# Altium project LPCB218__RLOOP__COMMAND_NODE.PrjPCB (part 2 of 2)
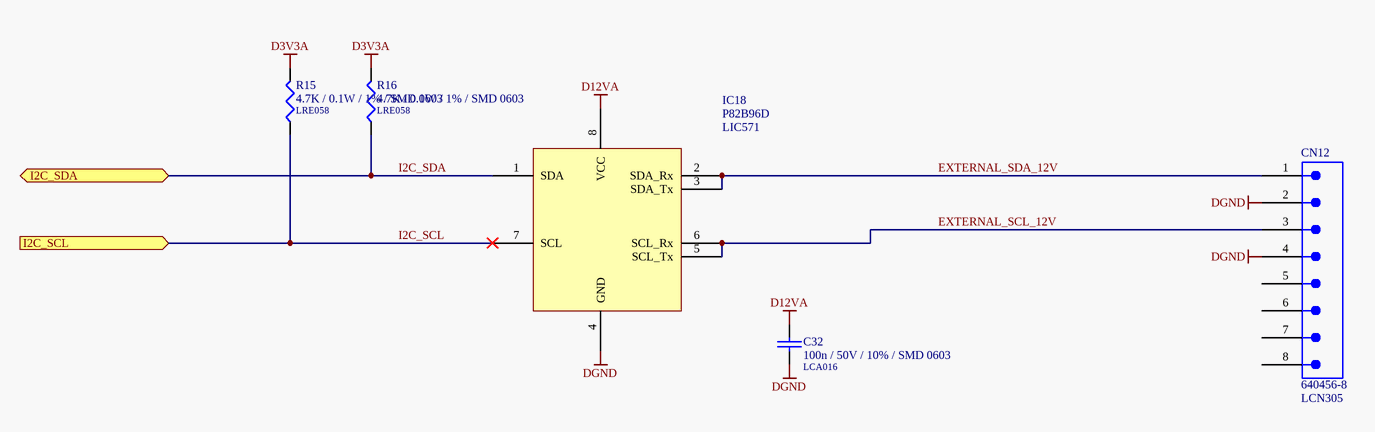
[diagram p14: LPCB218 - EXTERNAL I2C.SchDoc]

## Nets that join several sheets
AGND: LPCB218 - MLP INTERFACE (8 pins), U_LPCB218 - MLP INTERFACE/M1 (9 pins), U_LPCB218 - MLP INTERFACE/M2 (9 pins), U_LPCB218 - MLP INTERFACE/M3 (9 pins), U_LPCB218 - MLP INTERFACE/M4 (9 pins), LPCB218 - CORE INTERFACE (CN2.AGND)
D3V3A: LPCB218 - CHARGER INTERFACE (C1.1 IC1.16), LPCB218 - RS485 MUX CONTROL (10 pins), LPCB218 - HEC1-4 (8 pins), LPCB218 - HEC5-8 (8 pins), LPCB218 - CORE INTERFACE (7 pins), LPCB218 - INTERNAL PRESSURE (C31.1 IC19.1 IC19.2), LPCB218 - EXTERNAL I2C (R15.2 R16.2)
D12VA: LPCB218 - CORE INTERFACE (CN2.D12V1 CN2.D12V2), LPCB218 - EXTERNAL I2C (C32.1 IC18.8)
DGND: LPCB218 - CHARGER INTERFACE (C4.2 CN1.8 IC1.15), U_LPCB218 - LIFT MECH RELAYS/L1 (CN7_L1.8 IC10_L1.2), U_LPCB218 - LIFT MECH RELAYS/L2 (CN7_L2.8 IC10_L2.2), U_LPCB218 - LIFT MECH RELAYS/L3 (CN7_L3.8 IC10_L3.2), U_LPCB218 - LIFT MECH RELAYS/L4 (CN7_L4.8 IC10_L4.2), U_LPCB218 - LIFT MECH RELAYS/L5 (CN7_L5.8 IC10_L5.2), U_LPCB218 - LIFT MECH RELAYS/L6 (CN7_L6.8 IC10_L6.2), U_LPCB218 - LIFT MECH RELAYS/L7 (CN7_L7.8 IC10_L7.2), U_LPCB218 - LIFT MECH RELAYS/L8 (CN7_L8.8 IC10_L8.2), LPCB218 - RS485 MUX CONTROL (14 pins), LPCB218 - HEC1-4 (24 pins), LPCB218 - HEC5-8 (24 pins), LPCB218 - PARK BRAKE (CN10.8 CN11.8 IC13.2 IC14.2), LPCB218 - CORE INTERFACE (6 pins), LPCB218 - INTERNAL PRESSURE (C31.2 IC19.3 IC19.4), LPCB218 - EXTERNAL I2C (C32.2 CN12.2 CN12.4 IC18.4)
P24VA: U_LPCB218 - LIFT MECH RELAYS/L1 (CN7_L1.1 D1_L1.3 IC20_L1.A RLY1_L1.1), U_LPCB218 - LIFT MECH RELAYS/L2 (CN7_L2.1 D1_L2.3 IC20_L2.A RLY1_L2.1), U_LPCB218 - LIFT MECH RELAYS/L3 (CN7_L3.1 D1_L3.3 IC20_L3.A RLY1_L3.1), U_LPCB218 - LIFT MECH RELAYS/L4 (CN7_L4.1 D1_L4.3 IC20_L4.A RLY1_L4.1), U_LPCB218 - LIFT MECH RELAYS/L5 (CN7_L5.1 D1_L5.3 IC20_L5.A RLY1_L5.1), U_LPCB218 - LIFT MECH RELAYS/L6 (CN7_L6.1 D1_L6.3 IC20_L6.A RLY1_L6.1), U_LPCB218 - LIFT MECH RELAYS/L7 (CN7_L7.1 D1_L7.3 IC20_L7.A RLY1_L7.1), U_LPCB218 - LIFT MECH RELAYS/L8 (CN7_L8.1 D1_L8.3 IC20_L8.A RLY1_L8.1), LPCB218 - PARK BRAKE (6 pins), LPCB218 - MLP INTERFACE (D2.1 D3.1 D4.1 D5.1), U_LPCB218 - MLP INTERFACE/M1 (C22_M1.1 C23_M1.1 IC11_M1.16), U_LPCB218 - MLP INTERFACE/M2 (C22_M2.1 C23_M2.1 IC11_M2.16), U_LPCB218 - MLP INTERFACE/M3 (C22_M3.1 C23_M3.1 IC11_M3.16), U_LPCB218 - MLP INTERFACE/M4 (C22_M4.1 C23_M4.1 IC11_M4.16), LPCB218 - CORE INTERFACE (CN2.P24V1 CN2.P24V2)
CHARGER_CTRL_RX: LPCB218 - CHARGER INTERFACE (IC1.9), LPCB218 - CORE INTERFACE (CN2.T23)
CHARGER_CTRL_TX: LPCB218 - CHARGER INTERFACE (IC1.10), LPCB218 - CORE INTERFACE (CN2.T22)
CHARGER_RS232_RX: LPCB218 - CHARGER INTERFACE (IC1.12), LPCB218 - CORE INTERFACE (CN2.T7)
CHARGER_RS232_TX: LPCB218 - CHARGER INTERFACE (IC1.11), LPCB218 - CORE INTERFACE (CN2.T8)
HEC_D1: LPCB218 - RS485 MUX CONTROL (IC15.20), LPCB218 - HEC1-4 (IC2.6 R5.2)
HEC_D2: LPCB218 - RS485 MUX CONTROL (IC15.19), LPCB218 - HEC1-4 (IC4.6 R7.2)
HEC_D3: LPCB218 - RS485 MUX CONTROL (IC15.18), LPCB218 - HEC1-4 (IC3.6 R6.2)
HEC_D4: LPCB218 - RS485 MUX CONTROL (IC15.17), LPCB218 - HEC1-4 (IC5.6 R8.2)
HEC_D5: LPCB218 - RS485 MUX CONTROL (IC17.20), LPCB218 - HEC5-8 (IC6.6 R9.2)
HEC_D6: LPCB218 - RS485 MUX CONTROL (IC17.19), LPCB218 - HEC5-8 (IC8.6 R11.2)
HEC_D7: LPCB218 - RS485 MUX CONTROL (IC17.18), LPCB218 - HEC5-8 (IC7.6 R10.2)
HEC_D8: LPCB218 - RS485 MUX CONTROL (IC17.17), LPCB218 - HEC5-8 (IC9.6 R12.2)
HEC_DE1: LPCB218 - RS485 MUX CONTROL (IC16.4), LPCB218 - HEC1-4 (IC2.5)
HEC_DE2: LPCB218 - RS485 MUX CONTROL (IC16.5), LPCB218 - HEC1-4 (IC4.5)
HEC_DE3: LPCB218 - RS485 MUX CONTROL (IC16.6), LPCB218 - HEC1-4 (IC3.5)
HEC_DE4: LPCB218 - RS485 MUX CONTROL (IC16.7), LPCB218 - HEC1-4 (IC5.5)
HEC_DE5: LPCB218 - RS485 MUX CONTROL (IC16.12), LPCB218 - HEC5-8 (IC6.5)
HEC_DE6: LPCB218 - RS485 MUX CONTROL (IC16.11), LPCB218 - HEC5-8 (IC8.5)
HEC_DE7: LPCB218 - RS485 MUX CONTROL (IC16.10), LPCB218 - HEC5-8 (IC7.5)
HEC_DE8: LPCB218 - RS485 MUX CONTROL (IC16.9), LPCB218 - HEC5-8 (IC9.5)
HEC_R1: LPCB218 - RS485 MUX CONTROL (IC15.6), LPCB218 - HEC1-4 (IC2.3 TP5.1)
HEC_R2: LPCB218 - RS485 MUX CONTROL (IC15.7), LPCB218 - HEC1-4 (IC4.3 TP7.1)
HEC_R3: LPCB218 - RS485 MUX CONTROL (IC15.8), LPCB218 - HEC1-4 (IC3.3 TP6.1)
HEC_R4: LPCB218 - RS485 MUX CONTROL (IC15.9), LPCB218 - HEC1-4 (IC5.3 TP8.1)
HEC_R5: LPCB218 - RS485 MUX CONTROL (IC17.6), LPCB218 - HEC5-8 (IC6.3 TP9.1)
HEC_R6: LPCB218 - RS485 MUX CONTROL (IC17.7), LPCB218 - HEC5-8 (IC8.3 TP11.1)
HEC_R7: LPCB218 - RS485 MUX CONTROL (IC17.8), LPCB218 - HEC5-8 (IC7.3 TP10.1)
HEC_R8: LPCB218 - RS485 MUX CONTROL (IC17.9), LPCB218 - HEC5-8 (IC9.3 TP12.1)
I2C_SCL: LPCB218 - CORE INTERFACE (CN2.SCL), LPCB218 - INTERNAL PRESSURE (IC19.8 TP14.1), LPCB218 - EXTERNAL I2C (IC18.7 R15.1)
I2C_SDA: LPCB218 - CORE INTERFACE (CN2.SDA), LPCB218 - INTERNAL PRESSURE (IC19.7 TP15.1), LPCB218 - EXTERNAL I2C (IC18.1 R16.1)
LIFT_UP1: U_LPCB218 - LIFT MECH RELAYS/L1 (IC10_L1.1), LPCB218 - CORE INTERFACE (CN2.T6)
LIFT_UP2: U_LPCB218 - LIFT MECH RELAYS/L2 (IC10_L2.1), LPCB218 - CORE INTERFACE (CN2.T20)
LIFT_UP3: U_LPCB218 - LIFT MECH RELAYS/L3 (IC10_L3.1), LPCB218 - CORE INTERFACE (CN2.T25)
LIFT_UP4: U_LPCB218 - LIFT MECH RELAYS/L4 (IC10_L4.1), LPCB218 - CORE INTERFACE (CN2.T32)
LIFT_UP5: U_LPCB218 - LIFT MECH RELAYS/L5 (IC10_L5.1), LPCB218 - CORE INTERFACE (CN2.T5)
LIFT_UP6: U_LPCB218 - LIFT MECH RELAYS/L6 (IC10_L6.1), LPCB218 - CORE INTERFACE (CN2.T24)
LIFT_UP7: U_LPCB218 - LIFT MECH RELAYS/L7 (IC10_L7.1), LPCB218 - CORE INTERFACE (CN2.T26)
LIFT_UP8: U_LPCB218 - LIFT MECH RELAYS/L8 (IC10_L8.1), LPCB218 - CORE INTERFACE (CN2.T33)
MA420IN1: LPCB218 - MLP INTERFACE (CN8.2), U_LPCB218 - MLP INTERFACE/M1 (IC11_M1.3)
MA420IN2: LPCB218 - MLP INTERFACE (CN8.4), U_LPCB218 - MLP INTERFACE/M2 (IC11_M2.3)
MA420IN3: LPCB218 - MLP INTERFACE (CN9.2), U_LPCB218 - MLP INTERFACE/M3 (IC11_M3.3)
MA420IN4: LPCB218 - MLP INTERFACE (CN9.4), U_LPCB218 - MLP INTERFACE/M4 (IC11_M4.3)
MLP_OUT1: U_LPCB218 - MLP INTERFACE/M1 (5 pins), LPCB218 - CORE INTERFACE (CN2.A10)
MLP_OUT2: U_LPCB218 - MLP INTERFACE/M2 (5 pins), LPCB218 - CORE INTERFACE (CN2.A11)
MLP_OUT3: U_LPCB218 - MLP INTERFACE/M3 (5 pins), LPCB218 - CORE INTERFACE (CN2.A12)
MLP_OUT4: U_LPCB218 - MLP INTERFACE/M4 (5 pins), LPCB218 - CORE INTERFACE (CN2.A13)
PARK_BRAKE: LPCB218 - PARK BRAKE (IC13.1 IC14.1), LPCB218 - CORE INTERFACE (CN2.T2)
RS485_MUX14_SA0: LPCB218 - RS485 MUX CONTROL (IC15.11 IC15.15 IC16.2 TP1.1), LPCB218 - CORE INTERFACE (CN2.T14)
RS485_MUX14_SA1: LPCB218 - RS485 MUX CONTROL (IC15.12 IC15.14 IC16.3 TP2.1), LPCB218 - CORE INTERFACE (CN2.T15)
RS485_MUX58_SA0: LPCB218 - RS485 MUX CONTROL (IC16.14 IC17.11 IC17.15 TP3.1), LPCB218 - CORE INTERFACE (CN2.T16)
RS485_MUX58_SA1: LPCB218 - RS485 MUX CONTROL (IC16.13 IC17.12 IC17.14 TP4.1), LPCB218 - CORE INTERFACE (CN2.T17)
RS485_RX14: LPCB218 - RS485 MUX CONTROL (IC15.5 TP16.1), LPCB218 - CORE INTERFACE (CN2.T0)
RS485_RX58: LPCB218 - RS485 MUX CONTROL (IC17.5 TP18.1), LPCB218 - CORE INTERFACE (CN2.T9)
RS485_TX14: LPCB218 - RS485 MUX CONTROL (IC15.1 TP17.1), LPCB218 - CORE INTERFACE (CN2.T1)
RS485_TX58: LPCB218 - RS485 MUX CONTROL (IC17.1 TP19.1), LPCB218 - CORE INTERFACE (CN2.T10)